# Altium schematic sheet NB3000_MP3_Decoder.SchDoc
size B
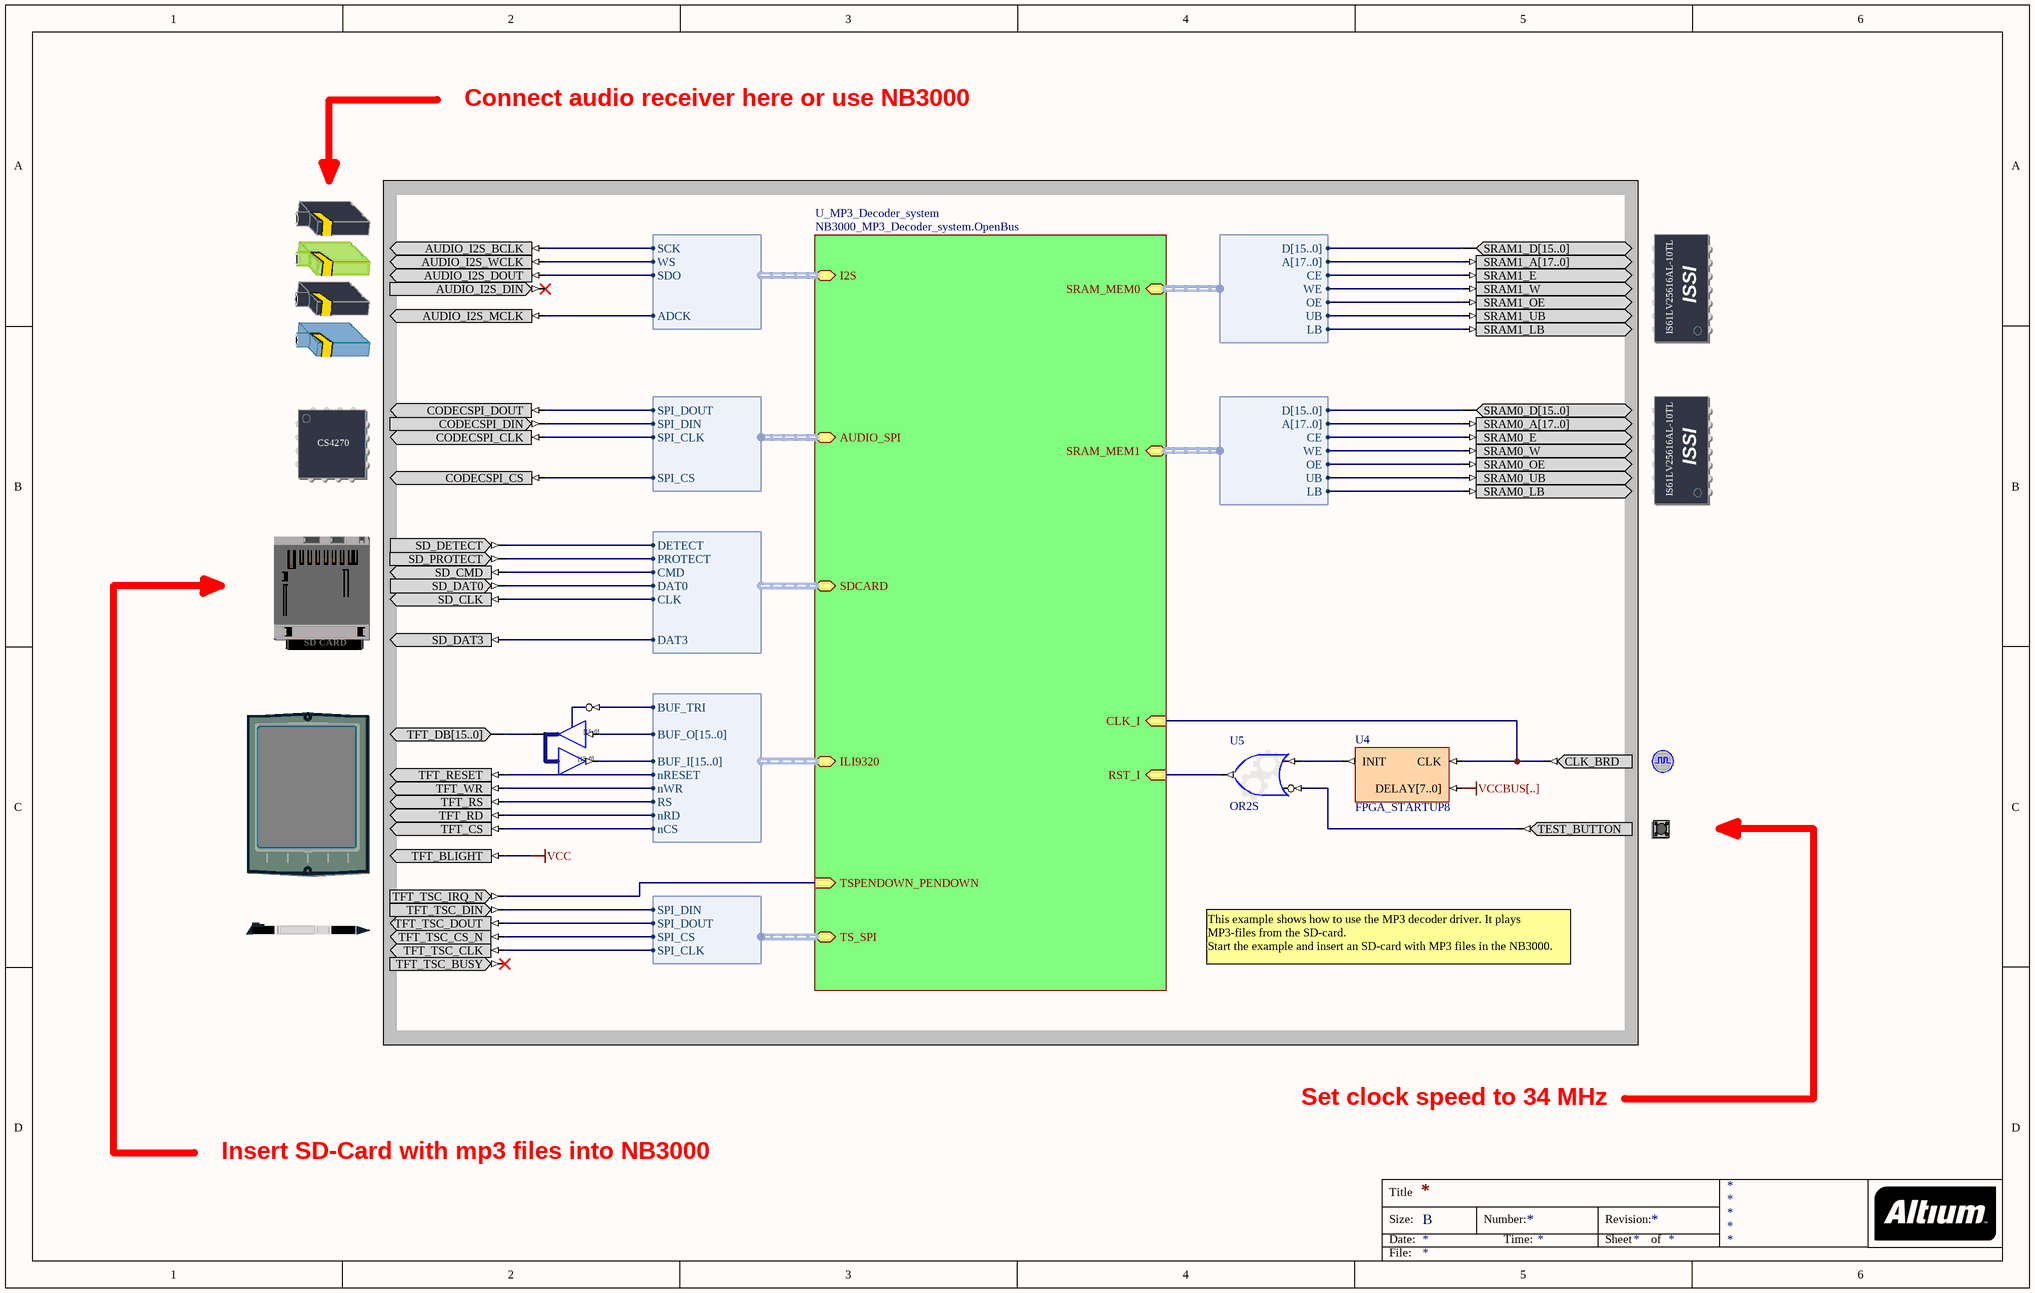
[diagram p0: NB3000_MP3_Decoder.SchDoc]

## Parts
(Parts that share a designator on the sheet are numbered #1, #2 ... from top to bottom, then left to right.)
?#1  AUDIO_CODEC  (value not drawn)
?#2  SRAM1  (value not drawn)
?#3  AUDIO_CODEC_CTRL  (value not drawn)
?#4  SRAM0  (value not drawn)
?#5  SD_CARD  (value not drawn)
?#6  TFT_LCD  (value not drawn)
?#7  CLOCK_BOARD  (value not drawn)
?#8  TEST_BUTTON  (value not drawn)
?#9  TFT_PEN  (value not drawn)
U3  IOBUF16B  (value not drawn)
U4  FPGA_STARTUP8
U5  OR2S

## Sub-sheets
U_MP3_Decoder_system = NB3000_MP3_Decoder_system.OpenBus: RST_I (in), CLK_I (in), SRAM_MEM0 (harness WB_MEM_CTRL_SRAM16_A18), SRAM_MEM1 (harness WB_MEM_CTRL_SRAM16_A18), I2S (harness I2S_W_TX), SDCARD (harness WB_SDCARD), ILI9320 (harness VGA32_ILI9320), TS_SPI (harness SPI_W_NB), TSPENDOWN_PENDOWN (in), AUDIO_SPI (harness SPI_W_NB)

## Harnesses
WB_MEM_CTRL_SRAM16_A18: D[15..0], A[17..0], CE, WE, OE, UB, LB
I2S_W_TX: SCK, WS, SDO, ADCK
WB_SDCARD: DETECT, PROTECT, CMD, DAT0, CLK, DAT3
VGA32_ILI9320: BUF_TRI, BUF_O[15..0], BUF_I[15..0], nRESET, nWR, RS, nRD, nCS
SPI_W_NB: SPI_DOUT, SPI_DIN, SPI_CLK, SPI_CS

## Nets
VCC: ?#6.TFT_BLIGHT
VCCBUS[..]: U4.DELAY[7..0]
Net?#1_AUDIO_I2S_BCLK: ?#1.AUDIO_I2S_BCLK ; sheet U_MP3_Decoder_system/I2S.SCK
Net?#1_AUDIO_I2S_DOUT: ?#1.AUDIO_I2S_DOUT ; sheet U_MP3_Decoder_system/I2S.SDO
Net?#1_AUDIO_I2S_MCLK: ?#1.AUDIO_I2S_MCLK ; sheet U_MP3_Decoder_system/I2S.ADCK
Net?#1_AUDIO_I2S_WCLK: ?#1.AUDIO_I2S_WCLK ; sheet U_MP3_Decoder_system/I2S.WS
Net?#2_SRAM1_A[17..0]: ?#2.SRAM1_A[17..0] ; sheet U_MP3_Decoder_system/SRAM_MEM0.A[17..0]
Net?#2_SRAM1_D[15..0]: ?#2.SRAM1_D[15..0] ; sheet U_MP3_Decoder_system/SRAM_MEM0.D[15..0]
Net?#2_SRAM1_E: ?#2.SRAM1_E ; sheet U_MP3_Decoder_system/SRAM_MEM0.CE
Net?#2_SRAM1_LB: ?#2.SRAM1_LB ; sheet U_MP3_Decoder_system/SRAM_MEM0.LB
Net?#2_SRAM1_OE: ?#2.SRAM1_OE ; sheet U_MP3_Decoder_system/SRAM_MEM0.OE
Net?#2_SRAM1_UB: ?#2.SRAM1_UB ; sheet U_MP3_Decoder_system/SRAM_MEM0.UB
Net?#2_SRAM1_W: ?#2.SRAM1_W ; sheet U_MP3_Decoder_system/SRAM_MEM0.WE
Net?#3_CODECSPI_CLK: ?#3.CODECSPI_CLK ; sheet U_MP3_Decoder_system/AUDIO_SPI.SPI_CLK
Net?#3_CODECSPI_CS: ?#3.CODECSPI_CS ; sheet U_MP3_Decoder_system/AUDIO_SPI.SPI_CS
Net?#3_CODECSPI_DIN: ?#3.CODECSPI_DIN ; sheet U_MP3_Decoder_system/AUDIO_SPI.SPI_DIN
Net?#3_CODECSPI_DOUT: ?#3.CODECSPI_DOUT ; sheet U_MP3_Decoder_system/AUDIO_SPI.SPI_DOUT
Net?#4_SRAM0_A[17..0]: ?#4.SRAM0_A[17..0] ; sheet U_MP3_Decoder_system/SRAM_MEM1.A[17..0]
Net?#4_SRAM0_D[15..0]: ?#4.SRAM0_D[15..0] ; sheet U_MP3_Decoder_system/SRAM_MEM1.D[15..0]
Net?#4_SRAM0_E: ?#4.SRAM0_E ; sheet U_MP3_Decoder_system/SRAM_MEM1.CE
Net?#4_SRAM0_LB: ?#4.SRAM0_LB ; sheet U_MP3_Decoder_system/SRAM_MEM1.LB
Net?#4_SRAM0_OE: ?#4.SRAM0_OE ; sheet U_MP3_Decoder_system/SRAM_MEM1.OE
Net?#4_SRAM0_UB: ?#4.SRAM0_UB ; sheet U_MP3_Decoder_system/SRAM_MEM1.UB
Net?#4_SRAM0_W: ?#4.SRAM0_W ; sheet U_MP3_Decoder_system/SRAM_MEM1.WE
Net?#5_SD_CLK: ?#5.SD_CLK ; sheet U_MP3_Decoder_system/SDCARD.CLK
Net?#5_SD_CMD: ?#5.SD_CMD ; sheet U_MP3_Decoder_system/SDCARD.CMD
Net?#5_SD_DAT0: ?#5.SD_DAT0 ; sheet U_MP3_Decoder_system/SDCARD.DAT0
Net?#5_SD_DAT3: ?#5.SD_DAT3 ; sheet U_MP3_Decoder_system/SDCARD.DAT3
Net?#5_SD_DETECT: ?#5.SD_DETECT ; sheet U_MP3_Decoder_system/SDCARD.DETECT
Net?#5_SD_PROTECT: ?#5.SD_PROTECT ; sheet U_MP3_Decoder_system/SDCARD.PROTECT
Net?#6_TFT_CS: ?#6.TFT_CS ; sheet U_MP3_Decoder_system/ILI9320.nCS
Net?#6_TFT_DB[15..0]: ?#6.TFT_DB[15..0] U3.IO[15..0]
Net?#6_TFT_RD: ?#6.TFT_RD ; sheet U_MP3_Decoder_system/ILI9320.nRD
Net?#6_TFT_RESET: ?#6.TFT_RESET ; sheet U_MP3_Decoder_system/ILI9320.nRESET
Net?#6_TFT_RS: ?#6.TFT_RS ; sheet U_MP3_Decoder_system/ILI9320.RS
Net?#6_TFT_WR: ?#6.TFT_WR ; sheet U_MP3_Decoder_system/ILI9320.nWR
Net?#7_CLK_BRD: ?#7.CLK_BRD U4.CLK ; sheet U_MP3_Decoder_system/CLK_I
Net?#8_TEST_BUTTON: ?#8.TEST_BUTTON U5.I1
Net?#9_TFT_TSC_CLK: ?#9.TFT_TSC_CLK ; sheet U_MP3_Decoder_system/TS_SPI.SPI_CLK
Net?#9_TFT_TSC_CS_N: ?#9.TFT_TSC_CS_N ; sheet U_MP3_Decoder_system/TS_SPI.SPI_CS
Net?#9_TFT_TSC_DIN: ?#9.TFT_TSC_DIN ; sheet U_MP3_Decoder_system/TS_SPI.SPI_DIN
Net?#9_TFT_TSC_DOUT: ?#9.TFT_TSC_DOUT ; sheet U_MP3_Decoder_system/TS_SPI.SPI_DOUT
Net?#9_TFT_TSC_IRQ_N: ?#9.TFT_TSC_IRQ_N ; sheet U_MP3_Decoder_system/TSPENDOWN_PENDOWN
NetU3_I[15..0]: U3.I[15..0] ; sheet U_MP3_Decoder_system/ILI9320.BUF_O[15..0]
NetU3_O[15..0]: U3.O[15..0] ; sheet U_MP3_Decoder_system/ILI9320.BUF_I[15..0]
NetU3_T: U3.T ; sheet U_MP3_Decoder_system/ILI9320.BUF_TRI
NetU4_INIT: U4.INIT U5.I0
NetU5_O: U5.O ; sheet U_MP3_Decoder_system/RST_I

Not connected (* = marked no-connect by the designer): ?#1 AUDIO_I2S_DIN*; ?#9 TFT_TSC_BUSY*

## Notes on the sheet
- Connect audio receiver here or use NB3000
- This example shows how to use the MP3 decoder driver. It plays MP3-files from the SD-card.
  Start the example and insert an SD-card with MP3 files in the NB3000.
- Set clock speed to 34 MHz
- Insert SD-Card with mp3 files into NB3000
- Title
- Size:
- Date:
- B
- Number:
- Time:
- Revision:
- Sheet
- of
- File:
- (in symbol AUDIO_CODEC_CTRL) CS4270
- (in symbol IOBUF16B) [15..0]
- (in symbol SD_CARD) SD CARD
- (in symbol SRAM0) ISSI; IS61LV25616AL-10TL
- (in symbol SRAM1) ISSI; IS61LV25616AL-10TL

## Library data of the parts
?#1 = AUDIO_CODEC: Audio Codec; PortComponent: True; IncludeInDSF: AUDIO_CS4270; Published: 22-Jan-2007; Publisher: Altium Limited; HelpURL: https://wiki.altium.com/display/ADOH/NanoBoard+3000+-+Audio+CODEC
?#2 = SRAM1: Free Static RAM - Daughterboard; PortComponent: True; Published: 14-May-2007; Publisher: Altium Limited; HelpURL: https://wiki.altium.com/display/ADOH/NanoBoard+3000+-+Independent+SRAM
?#3 = AUDIO_CODEC_CTRL: Audio Codec Control; PortComponent: True; Published: 22-Jan-2007; Publisher: Altium Limited; HelpURL: https://wiki.altium.com/display/ADOH/NanoBoard+3000+-+Audio+CODEC
?#4 = SRAM0: Free Static RAM - Daughterboard; PortComponent: True; Published: 14-May-2007; Publisher: Altium Limited; HelpURL: https://wiki.altium.com/display/ADOH/NanoBoard+3000+-+Independent+SRAM
?#5 = SD_CARD: Secure Digital Card Socket; PortComponent: True; Published: 22-Jan-2007; Publisher: Altium Limited; UseInDSF: True; HelpURL: https://wiki.altium.com/display/ADOH/NanoBoard+3000+-+SD+Card+Reader+%28User+FPGA%29
?#6 = TFT_LCD: TFT LCD Panel; PortComponent: True; Published: 22-Jan-2007; Publisher: Altium Limited; HelpURL: https://wiki.altium.com/display/ADOH/NanoBoard+3000+-+TFT+LCD+Panel+%28with+Touch+Screen%29
?#7 = CLOCK_BOARD: Global System Clock Supply; PortComponent: True; Published: 19-Nov-2003; Publisher: Altium Limited; HelpURL: https://wiki.altium.com/display/ADOH/NB2DSK01+-+System+Clocks; UseInDSF: True
?#8 = TEST_BUTTON: Test / Reset Button; PortComponent: True; Published: 19-Nov-2003; Publisher: Altium Limited; HelpURL: https://wiki.altium.com/display/ADOH/NB2DSK01+-+Daughter+Board+Test-Reset+Button
?#9 = TFT_PEN: Touch Screen Pen Control; PortComponent: True; Published: 22-Jan-2007; Publisher: Altium Limited; HelpURL: https://wiki.altium.com/display/ADOH/NanoBoard+3000+-+TFT+LCD+Panel+%28with+Touch+Screen%29
U3 = IOBUF16B: 16-Bit Input/Output Buffer, Bus Version; SubClass: IOBUF; Enable: Low; Control: Common Control T; PortSize: 16; ArchiveName: GENERIC; VHDLIB_SIM: GENERIC_LIB; Published: 29-Jan-2004; Publisher: Altium Limited; LastRevisionNo: 1.00.00; HelpURL: CR0118 FPGA Generic Library Guide.pdf#page=293; ComponentLink1URL: CR0125 FPGA Buffer Resource Usage.pdf#page=91; ComponentLink1Description: Core &Resource Usage; FunctionalClass: Buffer; PortStyle: Bus Version
U4 = FPGA_STARTUP8: FPGA Startup With 8 Bit Delay; Published: 9-Dec-2004; Publisher: Altium Limited; HelpURL: CR0119 FPGA_STARTUPx Powerup Delay Unit.pdf; LastRevisionNo: 1.00.00; ComponentLink1Description: Core &Resource Usage; ComponentLink1URL: CR0139 FPGA Peripheral Resource Usage.pdf#page=11
U5 = GATE: Configurable Generic Gate; ConfiguratorName: GENERIC_GATE; ConfigurationParameters: {}Version[1.1]{}GateKind[OR]{}BusInput[False]{}GateInputType[Bit]{}GateOutputOption[Normal]{}BusWidth[8]{}RegisterOutputs[False]{}NegativeClockEdge[False]{}InputCount[2]{}InputInvert0[False]{}InputInvert1[True]{}; LastRevisionNo: 1.00.00; Published: 3-Sep-2008; Publisher: Altium Limited; HelpURL: https://wiki.altium.com/display/ADOH/Configurable+Generic+Library